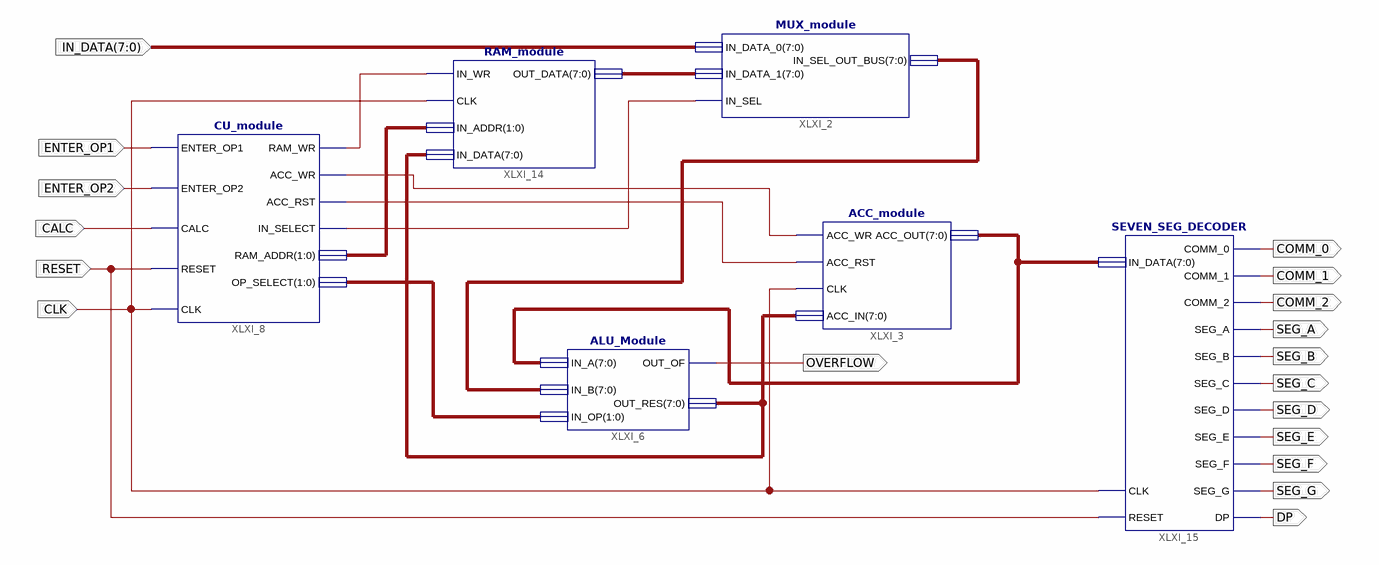
[diagram p0: schematic sheet 1]
// Xilinx ISE schematic TopLevel.sch (spartan3a) as structural Verilog: 6 symbols, 18 ports
module TopLevel (
  input  CLK,
  input  RESET,
  input  CALC,
  input  ENTER_OP2,
  input  ENTER_OP1,
  input  [7:0] IN_DATA,
  output COMM_0,
  output COMM_1,
  output COMM_2,
  output SEG_A,
  output SEG_B,
  output SEG_C,
  output SEG_D,
  output SEG_E,
  output SEG_F,
  output SEG_G,
  output DP,
  output OVERFLOW
);

  wire XLXN_9, XLXN_16, XLXN_17, XLXN_20;
  wire [1:0] XLXN_12, XLXN_19;
  wire [7:0] XLXN_11, XLXN_14, XLXN_18, XLXN_46;

  CU_module XLXI_8 (
    .ENTER_OP1(ENTER_OP1), .ENTER_OP2(ENTER_OP2), .CALC(CALC), .RESET(RESET), .CLK(CLK), .RAM_WR(XLXN_20),
    .ACC_WR(XLXN_17), .ACC_RST(XLXN_16), .IN_SELECT(XLXN_9), .RAM_ADDR(XLXN_12), .OP_SELECT(XLXN_19));
  MUX_module XLXI_2 (.IN_SEL(XLXN_9), .IN_DATA_0(IN_DATA), .IN_DATA_1(XLXN_11), .IN_SEL_OUT_BUS(XLXN_14));
  ACC_module XLXI_3 (.ACC_WR(XLXN_17), .ACC_RST(XLXN_16), .CLK(CLK), .ACC_IN(XLXN_18), .ACC_OUT(XLXN_46));
  ALU_Module XLXI_6 (.IN_A(XLXN_46), .IN_B(XLXN_14), .IN_OP(XLXN_19), .OUT_OF(OVERFLOW), .OUT_RES(XLXN_18));
  RAM_module XLXI_14 (.IN_WR(XLXN_20), .CLK(CLK), .IN_ADDR(XLXN_12), .IN_DATA(XLXN_18), .OUT_DATA(XLXN_11));
  SEVEN_SEG_DECODER XLXI_15 (
    .RESET(RESET), .CLK(CLK), .IN_DATA(XLXN_46), .COMM_0(COMM_0), .COMM_1(COMM_1), .COMM_2(COMM_2),
    .SEG_A(SEG_A), .SEG_B(SEG_B), .SEG_C(SEG_C), .SEG_D(SEG_D), .SEG_E(SEG_E), .SEG_F(SEG_F), .SEG_G(SEG_G),
    .DP(DP));
endmodule
